# EAGLE design board (EAGLE 6.3)
dd
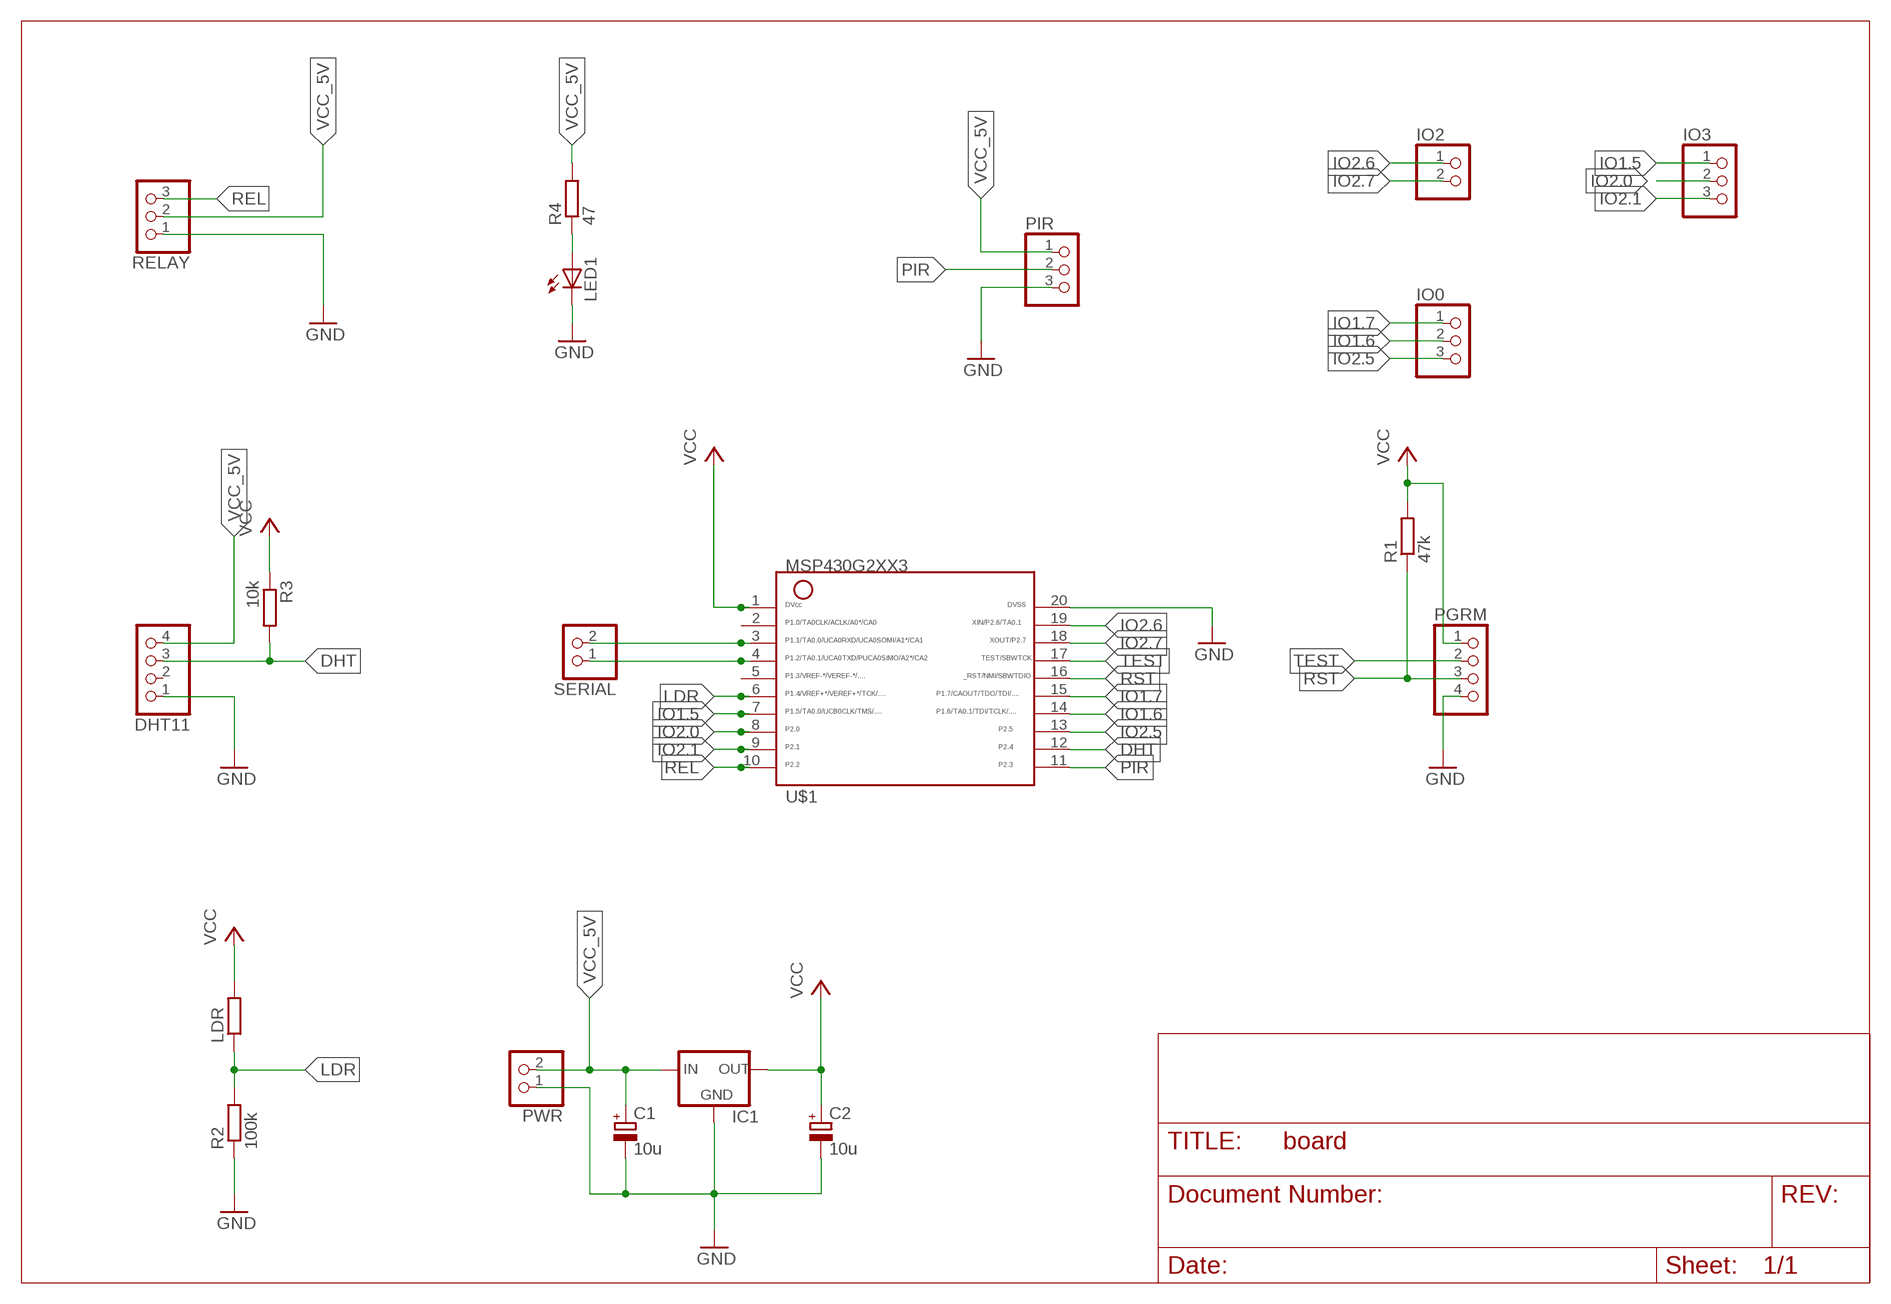
[diagram p0: schematic, sheet 1]

## Parts
C1  10u  CPOL-EUE2.5-5  [E2,5-5]
C2  10u  CPOL-EUE2.5-5  [E2,5-5]
DHT11  PINHD-1X4  [1X04]
IC1  MCP1700TRI  [TO92]
IO0  PINHD-1X3  [1X03]
IO2  PINHD-1X2  [1X02]
IO3  PINHD-1X3  [1X03]
LDR  R-EU_0207/5V  [0207/5V]
LED1  LED3MM  [LED3MM]
PGRM  PINHD-1X4  [1X04]
PIR  PINHD-1X3  [1X03]
PWR  PINHD-1X2  [1X02]
R1  47k  R-EU_0207/10  [0207/10]
R2  100k  R-EU_0207/10  [0207/10]
R3  10k  R-EU_0207/10  [0207/10]
R4  47  R-EU_0207/10  [0207/10]
RELAY  PINHD-1X3  [1X03]
SERIAL  PINHD-1X2  [1X02]
U$1  G2XX3---N20  [N20]

## Nets
DHT: DHT11.3 R3.2 U$1.12
GND: C1.- C2.- DHT11.1 IC1.1(GND) LED1.K(C) PGRM.4 PIR.3 PWR.1 R2.1 RELAY.1 U$1.20
IO1.5: IO3.1 U$1.7
IO1.6: IO0.2 U$1.14
IO1.7: IO0.1 U$1.15
IO2.0: IO3.2 U$1.8
IO2.1: IO3.3 U$1.9
IO2.5: IO0.3 U$1.13
IO2.6: IO2.1 U$1.19
IO2.7: IO2.2 U$1.18
LDR: LDR.1 R2.2 U$1.6
N$1: LED1.A R4.1
N$2: SERIAL.2 U$1.3
N$3: SERIAL.1 U$1.4
PIR: PIR.2 U$1.11
REL: RELAY.3 U$1.10
RST: PGRM.3 R1.1 U$1.16
TEST: PGRM.2 U$1.17
VCC: C2.+ IC1.3(OUT) LDR.2 PGRM.1 R1.2 R3.1 U$1.1
VCC_5V: C1.+ DHT11.4 IC1.2(IN) PIR.1 PWR.2 R4.2 RELAY.2
Unconnected: DHT11.2 U$1.2 U$1.5

## Library data of the parts
C1 C2 = rcl:CPOL-EU: POLARIZED CAPACITOR, European symbol
DHT11 PGRM = pinhead:PINHD-1X4: PIN HEADER
IC1 = adafruit:MCP1700: VOLTAGE REGULATOR
IO0 IO3 PIR RELAY = pinhead:PINHD-1X3: PIN HEADER
IO2 PWR SERIAL = pinhead:PINHD-1X2: PIN HEADER
LDR R1-R4 = rcl:R-EU_: RESISTOR, European symbol
LED1 = led:LED: LED OSRAM: - CHIPLED LG R971, LG N971, LY N971, LG Q971, LY Q971, LO R971, LY R971 LH N974, LH R974 LS Q976, LO Q976, LY Q976 LO Q996 - Hyper CHIPLED LW Q18S LB Q993, LB Q99A, LB R99A - SideLED LS A670, LO A670, LY A670, LG A670, LP A670 LB A673, LV A673, LT A673, LW A673 LH A674 LY A675 LS A676, LA A676, LO A676, LY A676, LW A676 LS A679, LY A679, LG A679 - Hyper Micro SIDELED® LS Y876, LA Y876, LO Y876, LY Y876 LT Y87S - SmartLED LW L88C, LW L88S LB L89C, LB L89S, LG L890 LS L89K, LO L89K, LY L89K LS L896, LA L896, LO L896, LY L896 - TOPLED LS T670, LO T670, LY T670, LG T670, LP T670 LSG T670, LSP T670, LSY T670, LOP T670, LYG T670 LG T671, LOG T671, LSG T671 LB T673, LV T673, LT T673, LW T673 LH T674 LS T676, LA T676, LO T676, LY T676, LB T676, LH T676, LSB T676, LW T676 LB T67C, LV T67C, LT T67C, LS T67K, LO T67K, LY T67K, LW E67C LS E67B, LA E67B, LO E67B, LY E67B, LB E67C, LV E67C, LT E67C LW T67C LS T679, LY T679, LG T679 LS T770, LO T770, LY T770, LG T770, LP T770 LB T773, LV T773, LT T773, LW T773 LH T774 LS E675, LA E675, LY E675, LS T675 LS T776, LA T776, LO T776, LY T776, LB T776 LHGB T686 LT T68C, LB T68C - Hyper Mini TOPLED® LB M676 - Mini TOPLED Santana® LG M470 LS M47K, LO M47K, LY M47K Source: http://www.osram.convergy.de LUXEON: - LUMILED® LXK2-PW12-R00, LXK2-PW12-S00, LXK2-PW14-U00, LXK2-PW14-V00 LXK2-PM12-R00, LXK2-PM12-S00, LXK2-PM14-U00 LXK2-PE12-Q00, LXK2-PE12-R00, LXK2-PE12-S00, LXK2-PE14-T00, LXK2-PE14-U00 LXK2-PB12-K00, LXK2-PB12-L00, LXK2-PB12-M00, LXK2-PB14-N00, LXK2-PB14-P00, LXK2-PB14-Q00 LXK2-PR12-L00, LXK2-PR12-M00, LXK2-PR14-Q00, LXK2-PR14-R00 LXK2-PD12-Q00, LXK2-PD12-R00, LXK2-PD12-S00 LXK2-PH12-R00, LXK2-PH12-S00 LXK2-PL12-P00, LXK2-PL12-Q00, LXK2-PL12-R00 Source: www.luxeon.com KINGBRIGHT: KA-3528ASYC Source: www.kingbright.com
U$1 = TI_MSP430_v16:G2XX3---N20: MSP430G2XX1 PDIP (N) 20 Pin Package

## Board
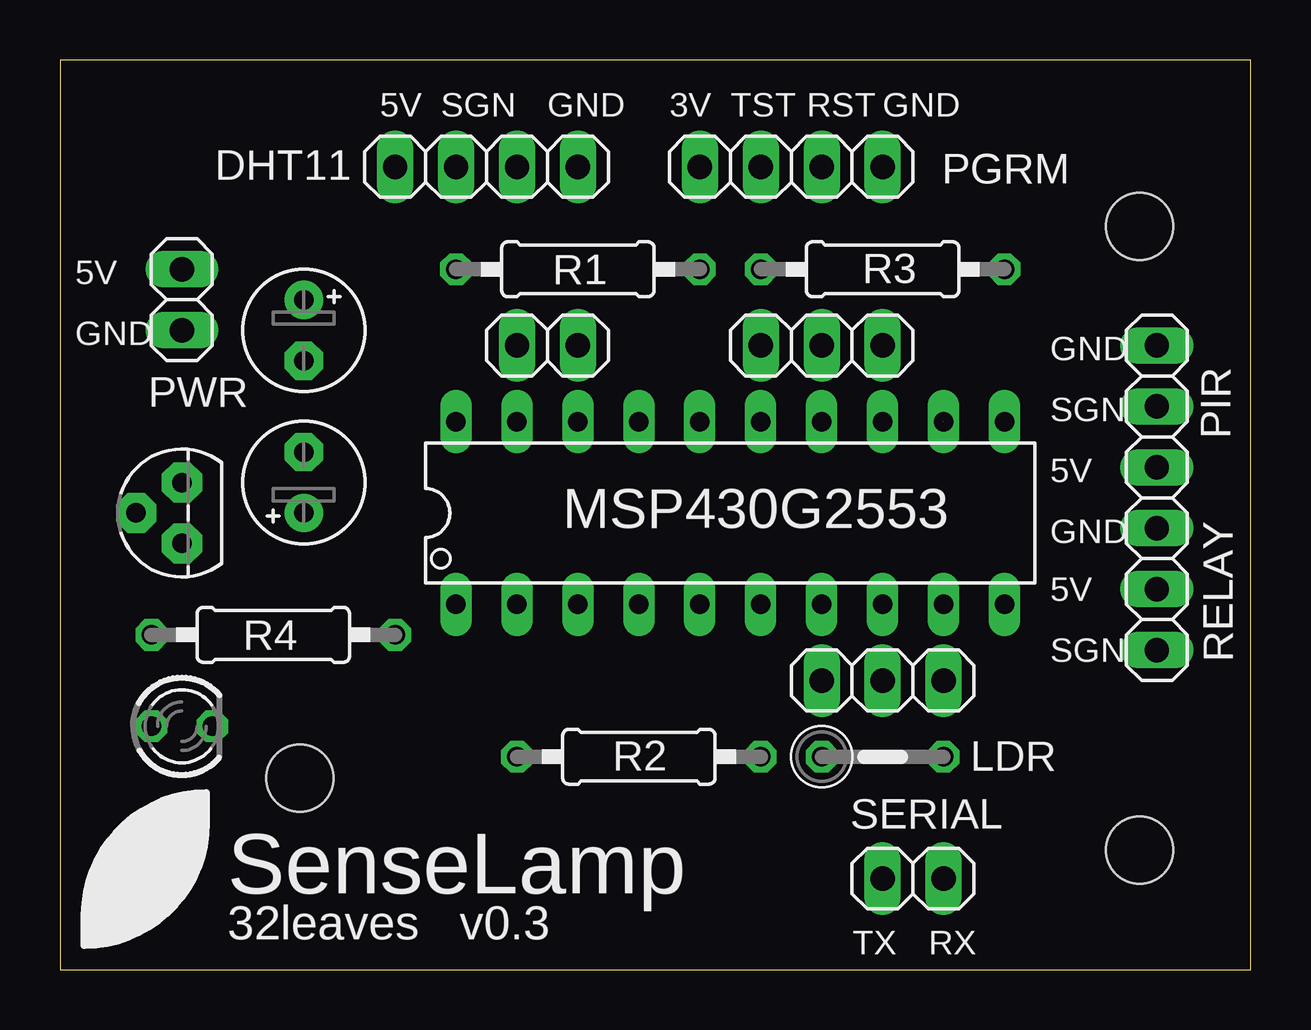
[diagram p1: board, top side]
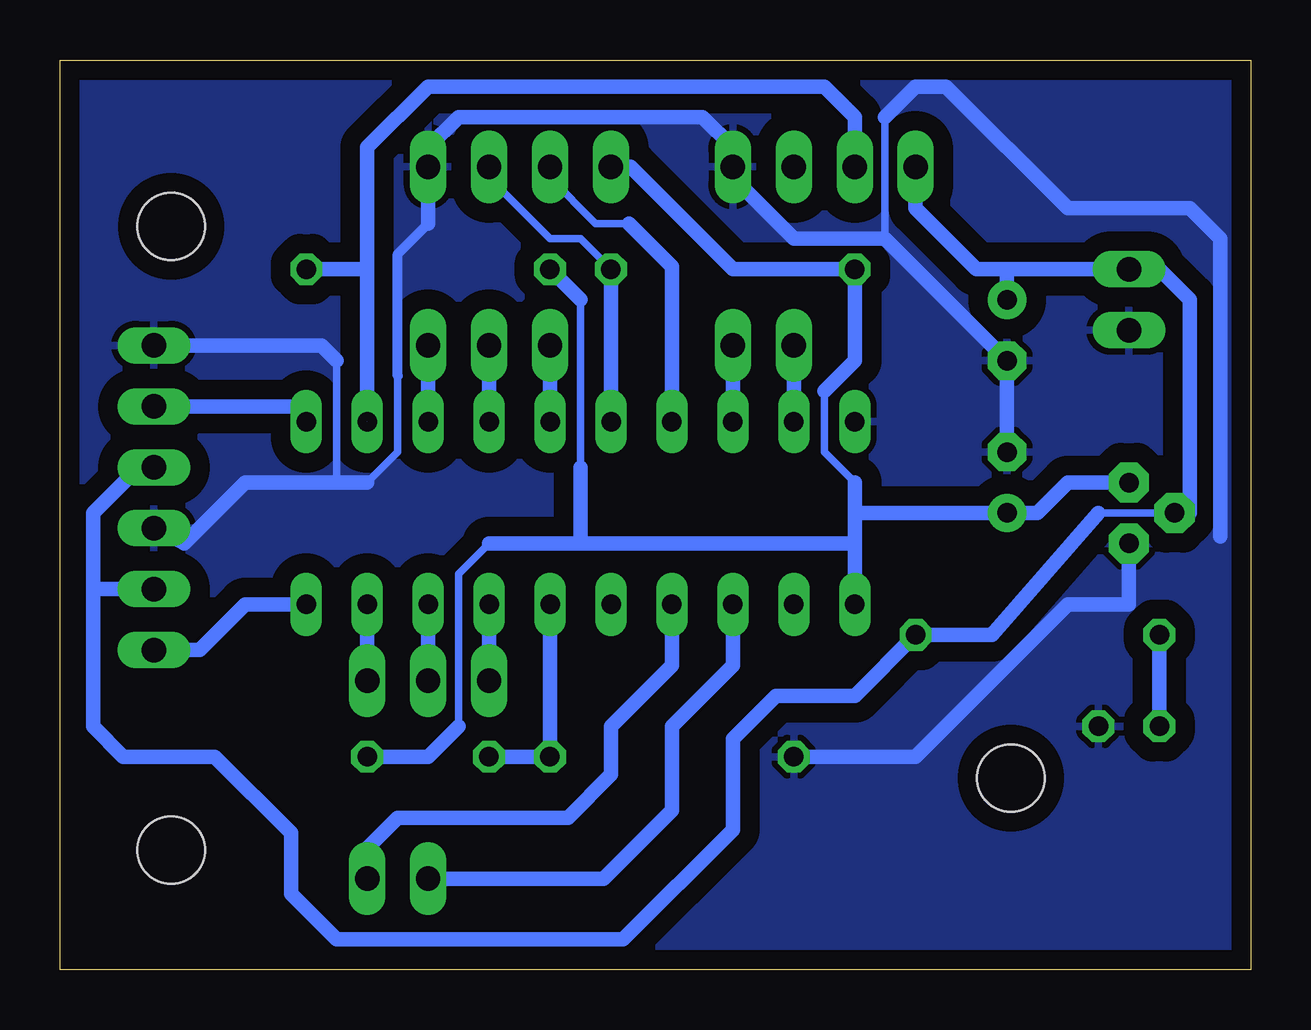
[diagram p2: board, bottom side, seen from below]

Size 49.63 x 37.94 mm. Coordinates in mm from the lower left corner, seen from the top.
Outline: 0,0 49.63,0 49.63,37.94 0,37.94 0,0
Copper layers (1*16): Top 0.035mm / dielectric 1.5mm / Bottom 0.035mm
Design rules "Fusion_eagle_rule_v1.1": minimum track width 6mil, minimum drill 12mil, track to track 6mil, track to pad 6mil, pad to pad 6mil, via to via 6mil, smd to smd 0mil, copper to edge 10mil, drill to drill 10mil, minimum pad ring 10mil, minimum via ring 6mil, stop-mask expansion 2mil, vias tented up to drill 100mil, thermal gap 10mil
Holes 2.8 mm at 10,8 45,31 45,5

### Footprints (pad centres in the part's own frame; a part is rotated, then mirrored left to right if it is on the bottom)
E2,5-5 = drill 0.813 pad 1.6: + -1.27,0 | drill 0.813 pad 1.6 octagon: - 1.27,0
1X04 = drill 1.016 long: 1 -3.81,0; 2 -1.27,0; 3 1.27,0; 4 3.81,0
TO92 = drill 0.813 pad 1.676 octagon: 1 -1.27,0; 2 0,1.905; 3 1.27,0
1X03 = drill 1.016 long: 1 -2.54,0; 2 0,0; 3 2.54,0
1X02 = drill 1.016 long: 1 -1.27,0; 2 1.27,0
0207/5V = drill 0.813 octagon: 1 -2.54,0; 2 2.54,0
LED3MM = drill 0.813 octagon: A -1.27,0; K 1.27,0
0207/10 = drill 0.813 octagon: 1 -5.08,0; 2 5.08,0
N20 = drill 0.813 long: 1 -11.435,-3.81; 2 -8.895,-3.81; 3 -6.355,-3.81; 4 -3.815,-3.81; 5 -1.275,-3.81; 6 1.265,-3.81; 7 3.805,-3.81; 8 6.345,-3.81; 9 8.885,-3.81; 10 11.425,-3.81; 11 11.425,3.81; 12 8.885,3.81; 13 6.345,3.81; 14 3.805,3.81; 15 1.265,3.81; 16 -1.275,3.81; 17 -3.815,3.81; 18 -6.355,3.81; 19 -8.895,3.81; 20 -11.435,3.81

### Placement (x,y rotation side)
C1  10.16,26.67 270 top
C2  10.16,20.32 90 top
DHT11  17.78,33.48 180 top
IC1  5.08,19.05 90 top
IO0  31.75,26.04 0 top
IO2  20.32,26.04 0 top
IO3  34.29,12.06 0 top
LDR  34.29,8.89 0 top
LED1  5.08,10.16 0 top
PGRM  30.48,33.48 0 top
PIR  45.72,23.5 90 top
PWR  5.08,27.94 90 top
R1  21.59,29.21 180 top
R2  24.13,8.89 0 top
R3  34.29,29.21 0 top
R4  8.89,13.97 0 top
RELAY  45.72,15.88 270 top
SERIAL  35.56,3.81 180 top
U$1  27.94,19.05 0 top

### Tracks (layer width: path | path; a pad name or v marks a point on that pad's centre or on a via)
DHT  (1 unrouted)
  Bottom 0.61: DHT11.3 16.51,35.56 17.78,36.83 34.29,36.83 36.83,34.29 36.83,29.21 | U$1.12 36.83,29.21 | R3.2 36.83,29.21
GND
  Bottom 0.254: U$1.20
  Bottom 0.305: 15.24,35.56 15.24,30.48 | 36.83,20.32 35.56,21.59 35.56,24.77 | 38.1,25.4 38.1,20.32
  Bottom 0.406: 35.56,24.77 35.56,29.84 34.29,31.11
  Bottom 0.61: R2.1 13.97,8.89 7.62,15.24 5.08,15.24 IC1.1 | 34.29,32.49 PGRM.4 | C2.- C1.- 15.24,30.48 19.05,30.48 21.59,33.02 DHT11.1 21.59,34.29 22.86,35.56 33.02,35.56 34.29,34.29 PGRM.4 | 1.27,18.08 1.27,30.48 2.54,31.75 7.62,31.75 12.7,36.83 13.97,36.83 15.24,35.56 | RELAY.1 44.45,17.78 41.91,20.32 38.1,20.32 36.83,20.32 | 34.29,31.11 PGRM.4 | PIR.3 38.73,26.04 38.1,25.4
  pour Bottom (isolate 0.813): 0,38.1 0,0 49.8,0 49.8,38.1
IO1.5
  Bottom 0.61: U$1.7 IO3.1
IO1.6
  Bottom 0.61: IO0.2 31.75,23.49 U$1.14
IO1.7
  Bottom 0.61: IO0.1 29.21,23.49 U$1.15
IO2.0
  Bottom 0.61: U$1.8 IO3.2
IO2.1
  Bottom 0.61: U$1.9 IO3.3
IO2.5
  Bottom 0.61: U$1.13 IO0.3
IO2.6
  Bottom 0.61: U$1.19 19.05,23.5 IO2.1
IO2.7
  Bottom 0.61: U$1.18 21.59,23.5 IO2.2
LDR
  Bottom 0.254: U$1.6
  Bottom 0.61: U$1.6 R2.2 LDR.1
N$1
  Bottom 0.61: R4.1 LED1.A
N$2
  Bottom 0.61: U$1.3 21.59,12.7 24.13,10.16 24.13,6.65 26.97,3.81 SERIAL.2
N$3
  Bottom 0.61: U$1.4 24.13,12.7 26.67,10.16 26.67,8.15 28.47,6.35 35.56,6.35 36.83,5.08 SERIAL.1
PIR
  Bottom 0.61: U$1.11 39.37,23.5 PIR.2
REL
  Bottom 0.61: U$1.10 41.91,15.24 43.81,13.34 RELAY.3
RST
  Bottom 0.305: R1.1 27.94,30.48 29.21,30.48 31.75,33.02
  Bottom 0.61: R1.1 U$1.16 | 31.75,33.02 PGRM.3
TEST
  Bottom 0.305: 29.21,33.02 27.3,31.11 25.93,31.11
  Bottom 0.61: U$1.17 24.13,29.32 25.93,31.11 | 29.21,33.02 PGRM.2
VCC
  Bottom 0.254: U$1.1
  Bottom 0.305: 16.51,20.32 17.78,21.59 17.78,24.13 | 33.02,10.16 33.02,16.51 31.75,17.78 | 27.94,27.94 27.94,20.95
  Bottom 0.61: 16.51,17.78 U$1.1 | 17.78,24.13 16.51,25.4 R1.2 21.59,29.21 25.86,33.48 PGRM.1 | LDR.2 34.29,8.89 33.02,10.16 | 31.75,17.78 27.94,17.78 | 27.94,17.78 16.51,17.78 | 16.51,17.78 16.51,19.05 | 16.51,20.32 16.51,19.05 | 16.51,19.05 C2.+ 8.89,19.05 7.62,20.32 IC1.3 | R3.1 27.94,27.94 | 27.94,20.95 27.94,17.78
VCC_5V
  Bottom 0.305: 2.54,19.05 IC1.2 6.35,19.05
  Bottom 0.61: 48.26,15.88 48.26,10.16 46.99,8.89 43.18,8.89 40.01,5.71 40.01,3.17 38.1,1.27 26.17,1.27 21.59,5.85 21.59,9.63 19.79,11.43 16.51,11.43 R4.2 10.79,13.97 6.35,19.05 | 48.26,15.88 RELAY.2 | 2.54,19.05 2.54,27.94 3.81,29.21 PWR.2 10.16,29.21 | PIR.1 46.35,20.95 48.26,19.05 48.26,15.88 | C1.+ 10.16,29.21 | 10.16,29.21 11.43,29.21 13.97,31.75 DHT11.4

### Text on the board
tPlace: 5V | SGN | GND | 3V | TST | RST | GND | 5V | GND | GND | SGN | 5V | MSP430G2553 | GND | 5V | SGN | SenseLamp | 32leaves v0.3 | TX | RX